# Altium schematic sheet 06_DDR_CONTROLLER.SchDoc: =title
size A3; Organization: 六零加智能科技有限公司; Address4: www.nidone.com.cn; DocumentNumber: kang jin; Revision: 1.0; SheetNumber: 6; SheetTotal: 23
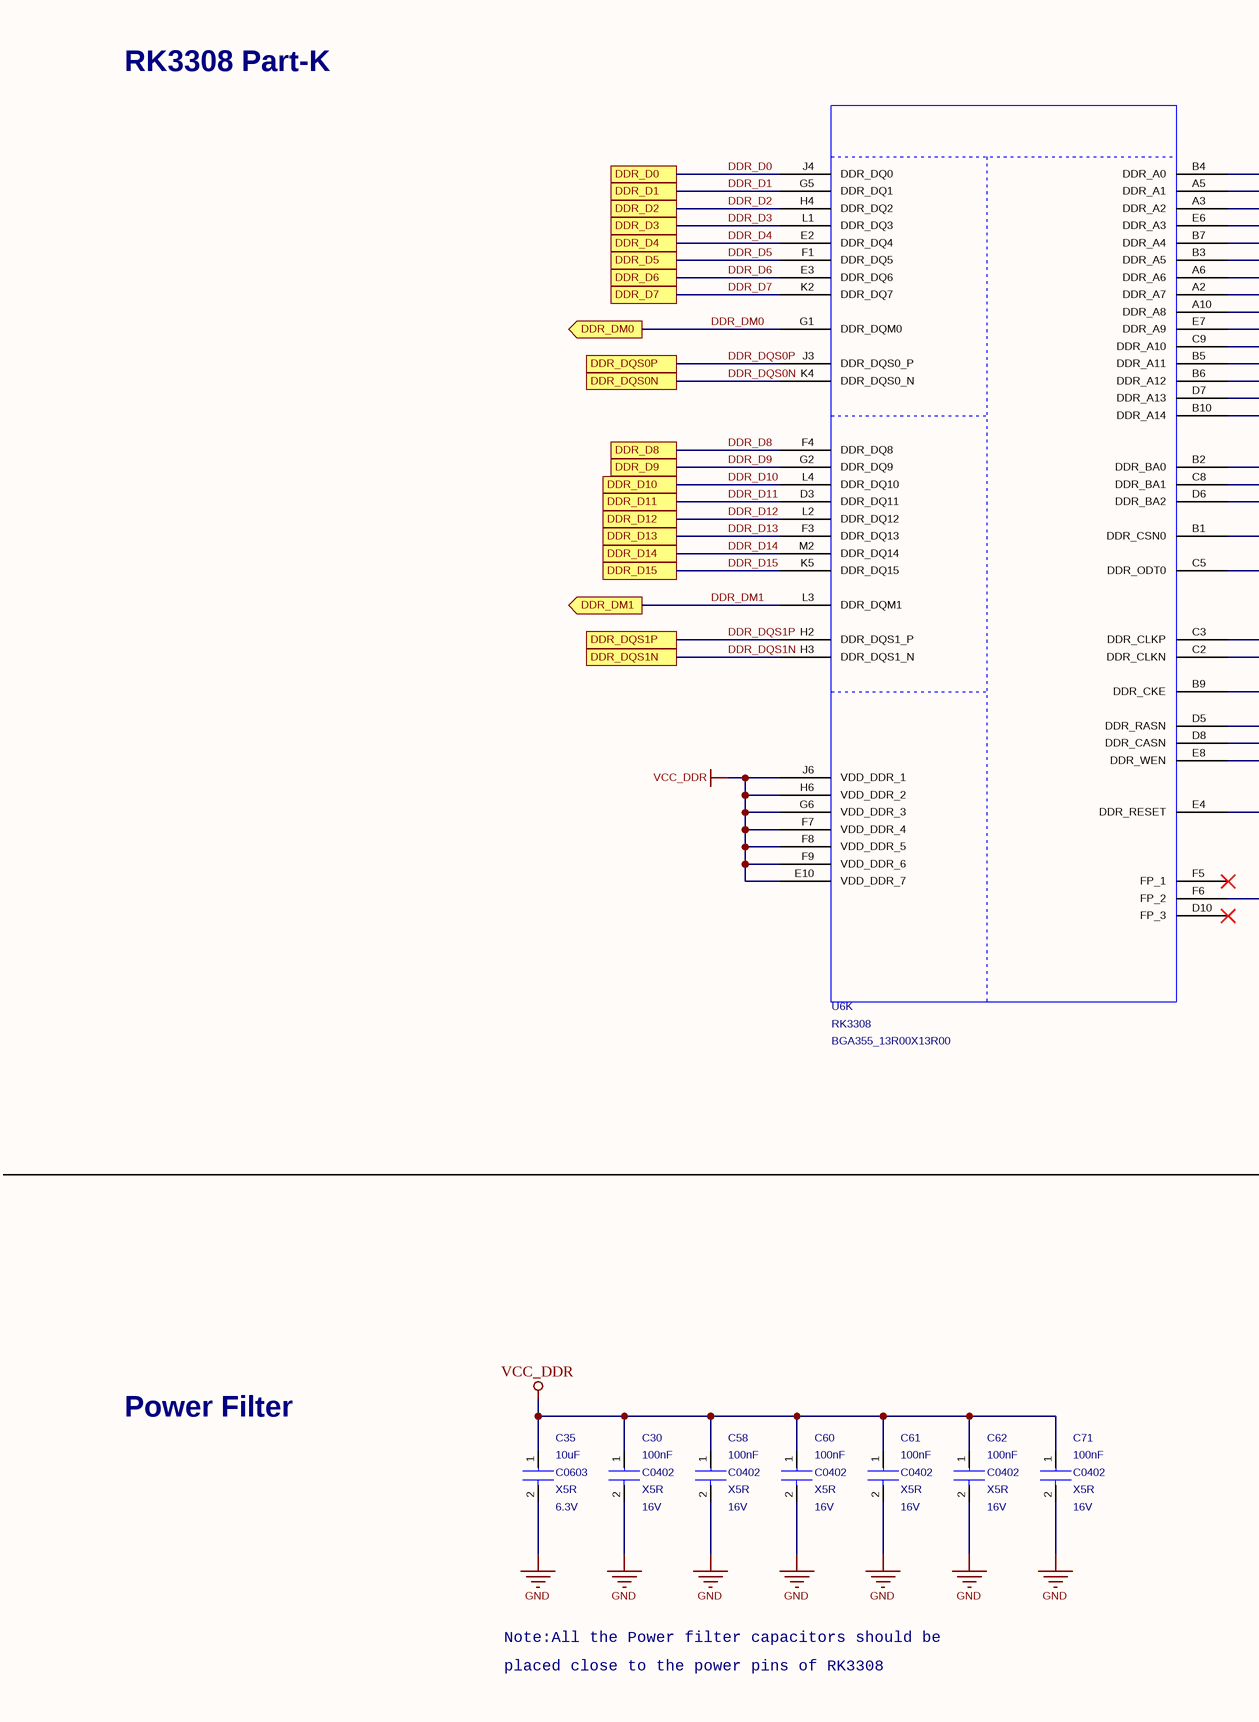
[diagram p0: 06_DDR_CONTROLLER.SchDoc, left]
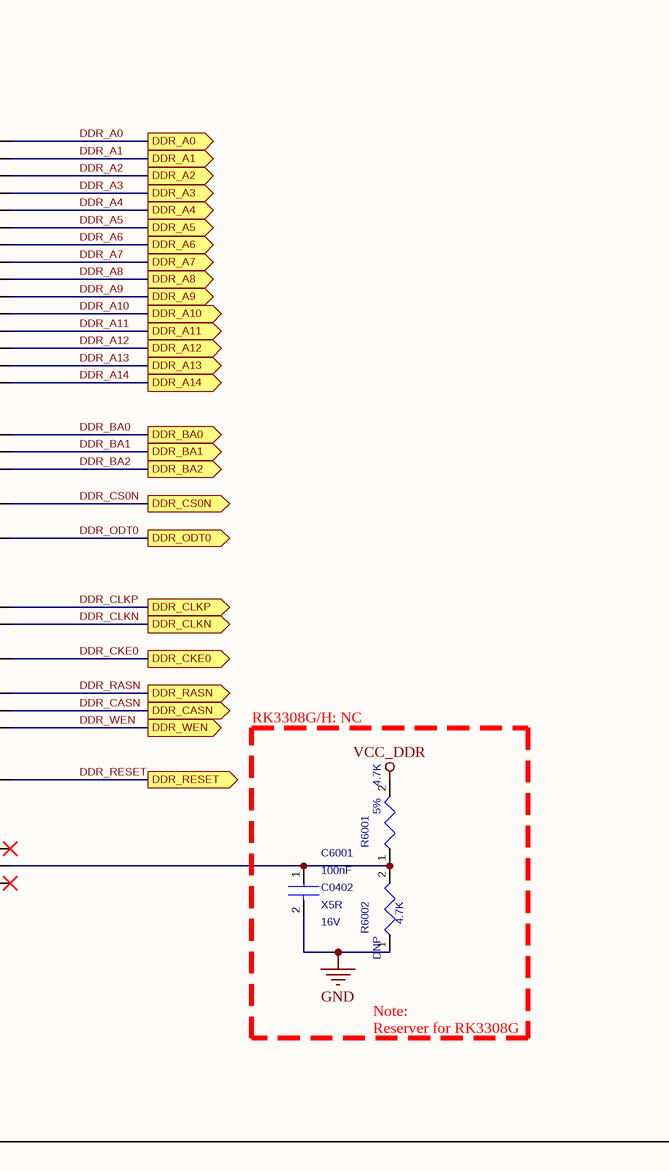
[diagram p1: 06_DDR_CONTROLLER.SchDoc, right]

## Parts
C30  value 100nF  Voltage: 16V  Dielectric: X5R  [C0402]  (hidden comment: CAP_NP_2)
C35  value 10uF  Dielectric: X5R  Voltage: 6.3V  [C0603]  (hidden comment: CAP_NP_2)
C58  value 100nF  Dielectric: X5R  Voltage: 16V  [C0402]  (hidden comment: CAP_NP_2)
C60  value 100nF  Voltage: 16V  Dielectric: X5R  [C0402]  (hidden comment: CAP_NP_2)
C61  value 100nF  Voltage: 16V  Dielectric: X5R  [C0402]  (hidden comment: CAP_NP_2)
C62  value 100nF  Voltage: 16V  Dielectric: X5R  [C0402]  (hidden comment: CAP_NP_2)
C71  value 100nF  Voltage: 16V  Dielectric: X5R  [C0402]  (hidden comment: CAP_NP_2)
C6001  value 100nF  Voltage: 16V  Dielectric: X5R  [C0402]  (hidden comment: CAP_NP_2)
R6001  value 4.7K  [R0402]  (hidden comment: RESISTOR)
R6002  value 4.7K  Tolerance: 5%  OPTION: DNP  [R0402]  (hidden comment: RESISTOR)
U6  RK3308  [BGA355_13R00X13R00]  (part K of 14)

## Ports
DDR_A0 (out), DDR_A1 (out), DDR_A2 (out), DDR_A3 (out), DDR_A4 (out), DDR_A5 (out), DDR_A6 (out), DDR_A7 (out), DDR_A8 (out), DDR_A9 (out), DDR_A10 (out), DDR_A11 (out), DDR_A12 (out), DDR_A13 (out), DDR_A14 (out), DDR_BA0 (out), DDR_BA1 (out), DDR_BA2 (out), DDR_CASN (out), DDR_CKE0 (out), DDR_CLKN (out), DDR_CLKP (out), DDR_CS0N (out), DDR_D0, DDR_D1, DDR_D2, DDR_D3, DDR_D4, DDR_D5, DDR_D6, DDR_D7, DDR_D8, DDR_D9, DDR_D10, DDR_D11, DDR_D12, DDR_D13, DDR_D14, DDR_D15, DDR_DM0 (out), DDR_DM1 (out), DDR_DQS0N, DDR_DQS0P, DDR_DQS1N, DDR_DQS1P, DDR_ODT0 (out), DDR_RASN (out), DDR_RESET (out), DDR_WEN (out)

## Nets
GND: C30.2 C35.2 C58.2 C60.2 C61.2 C62.2 C71.2 C6001.2 R6002.1
VCC_DDR: C30.1 C35.1 C58.1 C60.1 C61.1 C62.1 C71.1 R6001.2 U6.E10(VDD_DDR_7) U6.F7(VDD_DDR_4) U6.F8(VDD_DDR_5) U6.F9(VDD_DDR_6) U6.G6(VDD_DDR_3) U6.H6(VDD_DDR_2) U6.J6(VDD_DDR_1)
DDR_A0: U6.B4(DDR_A0) ; port DDR_A0
DDR_A1: U6.A5(DDR_A1) ; port DDR_A1
DDR_A2: U6.A3(DDR_A2) ; port DDR_A2
DDR_A3: U6.E6(DDR_A3) ; port DDR_A3
DDR_A4: U6.B7(DDR_A4) ; port DDR_A4
DDR_A5: U6.B3(DDR_A5) ; port DDR_A5
DDR_A6: U6.A6(DDR_A6) ; port DDR_A6
DDR_A7: U6.A2(DDR_A7) ; port DDR_A7
DDR_A8: U6.A10(DDR_A8) ; port DDR_A8
DDR_A9: U6.E7(DDR_A9) ; port DDR_A9
DDR_A10: U6.C9(DDR_A10) ; port DDR_A10
DDR_A11: U6.B5(DDR_A11) ; port DDR_A11
DDR_A12: U6.B6(DDR_A12) ; port DDR_A12
DDR_A13: U6.D7(DDR_A13) ; port DDR_A13
DDR_A14: U6.B10(DDR_A14) ; port DDR_A14
DDR_BA0: U6.B2(DDR_BA0) ; port DDR_BA0
DDR_BA1: U6.C8(DDR_BA1) ; port DDR_BA1
DDR_BA2: U6.D6(DDR_BA2) ; port DDR_BA2
DDR_CASN: U6.D8(DDR_CASN) ; port DDR_CASN
DDR_CKE0: U6.B9(DDR_CKE) ; port DDR_CKE0
DDR_CLKN: U6.C2(DDR_CLKN) ; port DDR_CLKN
DDR_CLKP: U6.C3(DDR_CLKP) ; port DDR_CLKP
DDR_CS0N: U6.B1(DDR_CSN0) ; port DDR_CS0N
DDR_D0: U6.J4(DDR_DQ0) ; port DDR_D0
DDR_D1: U6.G5(DDR_DQ1) ; port DDR_D1
DDR_D2: U6.H4(DDR_DQ2) ; port DDR_D2
DDR_D3: U6.L1(DDR_DQ3) ; port DDR_D3
DDR_D4: U6.E2(DDR_DQ4) ; port DDR_D4
DDR_D5: U6.F1(DDR_DQ5) ; port DDR_D5
DDR_D6: U6.E3(DDR_DQ6) ; port DDR_D6
DDR_D7: U6.K2(DDR_DQ7) ; port DDR_D7
DDR_D8: U6.F4(DDR_DQ8) ; port DDR_D8
DDR_D9: U6.G2(DDR_DQ9) ; port DDR_D9
DDR_D10: U6.L4(DDR_DQ10) ; port DDR_D10
DDR_D11: U6.D3(DDR_DQ11) ; port DDR_D11
DDR_D12: U6.L2(DDR_DQ12) ; port DDR_D12
DDR_D13: U6.F3(DDR_DQ13) ; port DDR_D13
DDR_D14: U6.M2(DDR_DQ14) ; port DDR_D14
DDR_D15: U6.K5(DDR_DQ15) ; port DDR_D15
DDR_DM0: U6.G1(DDR_DQM0) ; port DDR_DM0
DDR_DM1: U6.L3(DDR_DQM1) ; port DDR_DM1
DDR_DQS0N: U6.K4(DDR_DQS0_N) ; port DDR_DQS0N
DDR_DQS0P: U6.J3(DDR_DQS0_P) ; port DDR_DQS0P
DDR_DQS1N: U6.H3(DDR_DQS1_N) ; port DDR_DQS1N
DDR_DQS1P: U6.H2(DDR_DQS1_P) ; port DDR_DQS1P
DDR_ODT0: U6.C5(DDR_ODT0) ; port DDR_ODT0
DDR_RASN: U6.D5(DDR_RASN) ; port DDR_RASN
DDR_RESET: U6.E4(DDR_RESET) ; port DDR_RESET
DDR_WEN: U6.E8(DDR_WEN) ; port DDR_WEN
NetC6001_1: C6001.1 R6001.1 R6002.2 U6.F6(FP_2)

Not connected (* = marked no-connect by the designer): U6 D10(FP_3)* F5(FP_1)*

## Notes on the sheet
- RK3308 Part-K
- RK3308G/H: NC
- Reserver for RK3308G
- Note:
- Power Filter
- Note:All the Power filter capacitors should be
- placed close to the power pins of RK3308
- Title
- Size:
- Date:
- A3
- Engineer:
- Time:
- Revision:
- Sheet
- of
- File:

## Library data of the parts
C30 = CAP_NP_2: cap,100.00nF,+/-10%,16V,X5R,C0402; Manufacturer_PN: C1005X5R1C104K050BA; Manufacturer: TDK; Created_by: JJJ; Tolerance: 10%; Priority: A; Source_Path: Z:\RK_STANDARD_LIBRARY\CADENCE_CIS\RK_DISCRETE.OLB; Number: 1; C_Voltage: 6.3V; PCB DECAL: C0402; Part_Type: C0402; RK_PN: C1005X5R1C104K050BA
C35 = CAP_NP_2: cap,10.00uF,+/-10%,6.3V,X5R,C0603; Manufacturer: TDK; RK_PN: C1608X5R0J106K080AB; Priority: A; Tolerance: 10%; Created_by: JJJ; Source_Path: Z:\RK_STANDARD_LIBRARY\CADENCE_CIS\RK_DISCRETE.OLB; Number: 1; PCB DECAL: C0603; Part_Type: C0603; Manufacturer_PN: C1608X5R0J106K080AB; C_Voltage: 6.3V
C58 = CAP_NP_2: cap,100.00nF,+/-10%,16V,X5R,C0402; Manufacturer: TDK; RK_PN: C1005X5R1C104K050BA; Priority: A; Tolerance: 10%; Created_by: JJJ; Source_Path: Z:\RK_STANDARD_LIBRARY\CADENCE_CIS\RK_DISCRETE.OLB; Number: 1; PCB DECAL: C0402; Part_Type: C0402; Manufacturer_PN: C1005X5R1C104K050BA
C60-C62 C71 C6001 = CAP_NP_2: cap,100.00nF,+/-10%,16V,X5R,C0402; Manufacturer_PN: C1005X5R1C104K050BA; Manufacturer: TDK; Created_by: JJJ; Tolerance: 10%; Priority: A; Source_Path: Z:\RK_STANDARD_LIBRARY\CADENCE_CIS\RK_DISCRETE.OLB; Number: 1; PCB DECAL: C0402; Part_Type: C0402; RK_PN: C1005X5R1C104K050BA
R6001 = RESISTOR: ?用厚膜电阻,4K7,+/-5%,R0402,1/16W.; Manufacturer_PN: RC0402JR-074K7L; Manufacturer: YAGEO; Created_by: YTL; Wattage: 1/16W; Tolerance: 5%; Priority: A; OPTION: DNP; Source_Path: Z:\RK_STANDARD_LIBRARY\CADENCE_CIS\RK_DISCRETE.OLB; PCB DECAL: R0402; Part_Type: ?用厚膜电阻; RK_PN: RC0402JR-074K7L
R6002 = RESISTOR: ?用厚膜电阻,4K7,+/-5%,R0402,1/16W.; Manufacturer_PN: RC0402JR-074K7L; Manufacturer: YAGEO; Created_by: YTL; Wattage: 1/16W; Priority: A; Source_Path: Z:\RK_STANDARD_LIBRARY\CADENCE_CIS\RK_DISCRETE.OLB; PCB DECAL: R0402; Part_Type: ?用厚膜电阻; RK_PN: RC0402JR-074K7L
U6 = RK3308: Manufacturer: ROCKCHIP; Source_Path: E:\SCHEMETIC\RKSCH.OLB; Number: 1; PCB DECAL: BGA355_13R00X13R00; Value: RK3308; Manufacturer_PN: RK3308